# EasyEDA Pro project whisker-breeze.epro, schematic Schematic1_2
Board Name: Rev.B; Create Date: 2025-09-19; Page Name: P1; Project Name: 风扇调速器; Schematic Name: Schematic1_2; Update Date: 2025-09-20; Company: 嘉立创EDA; Page Size: A4; Version: V1.0
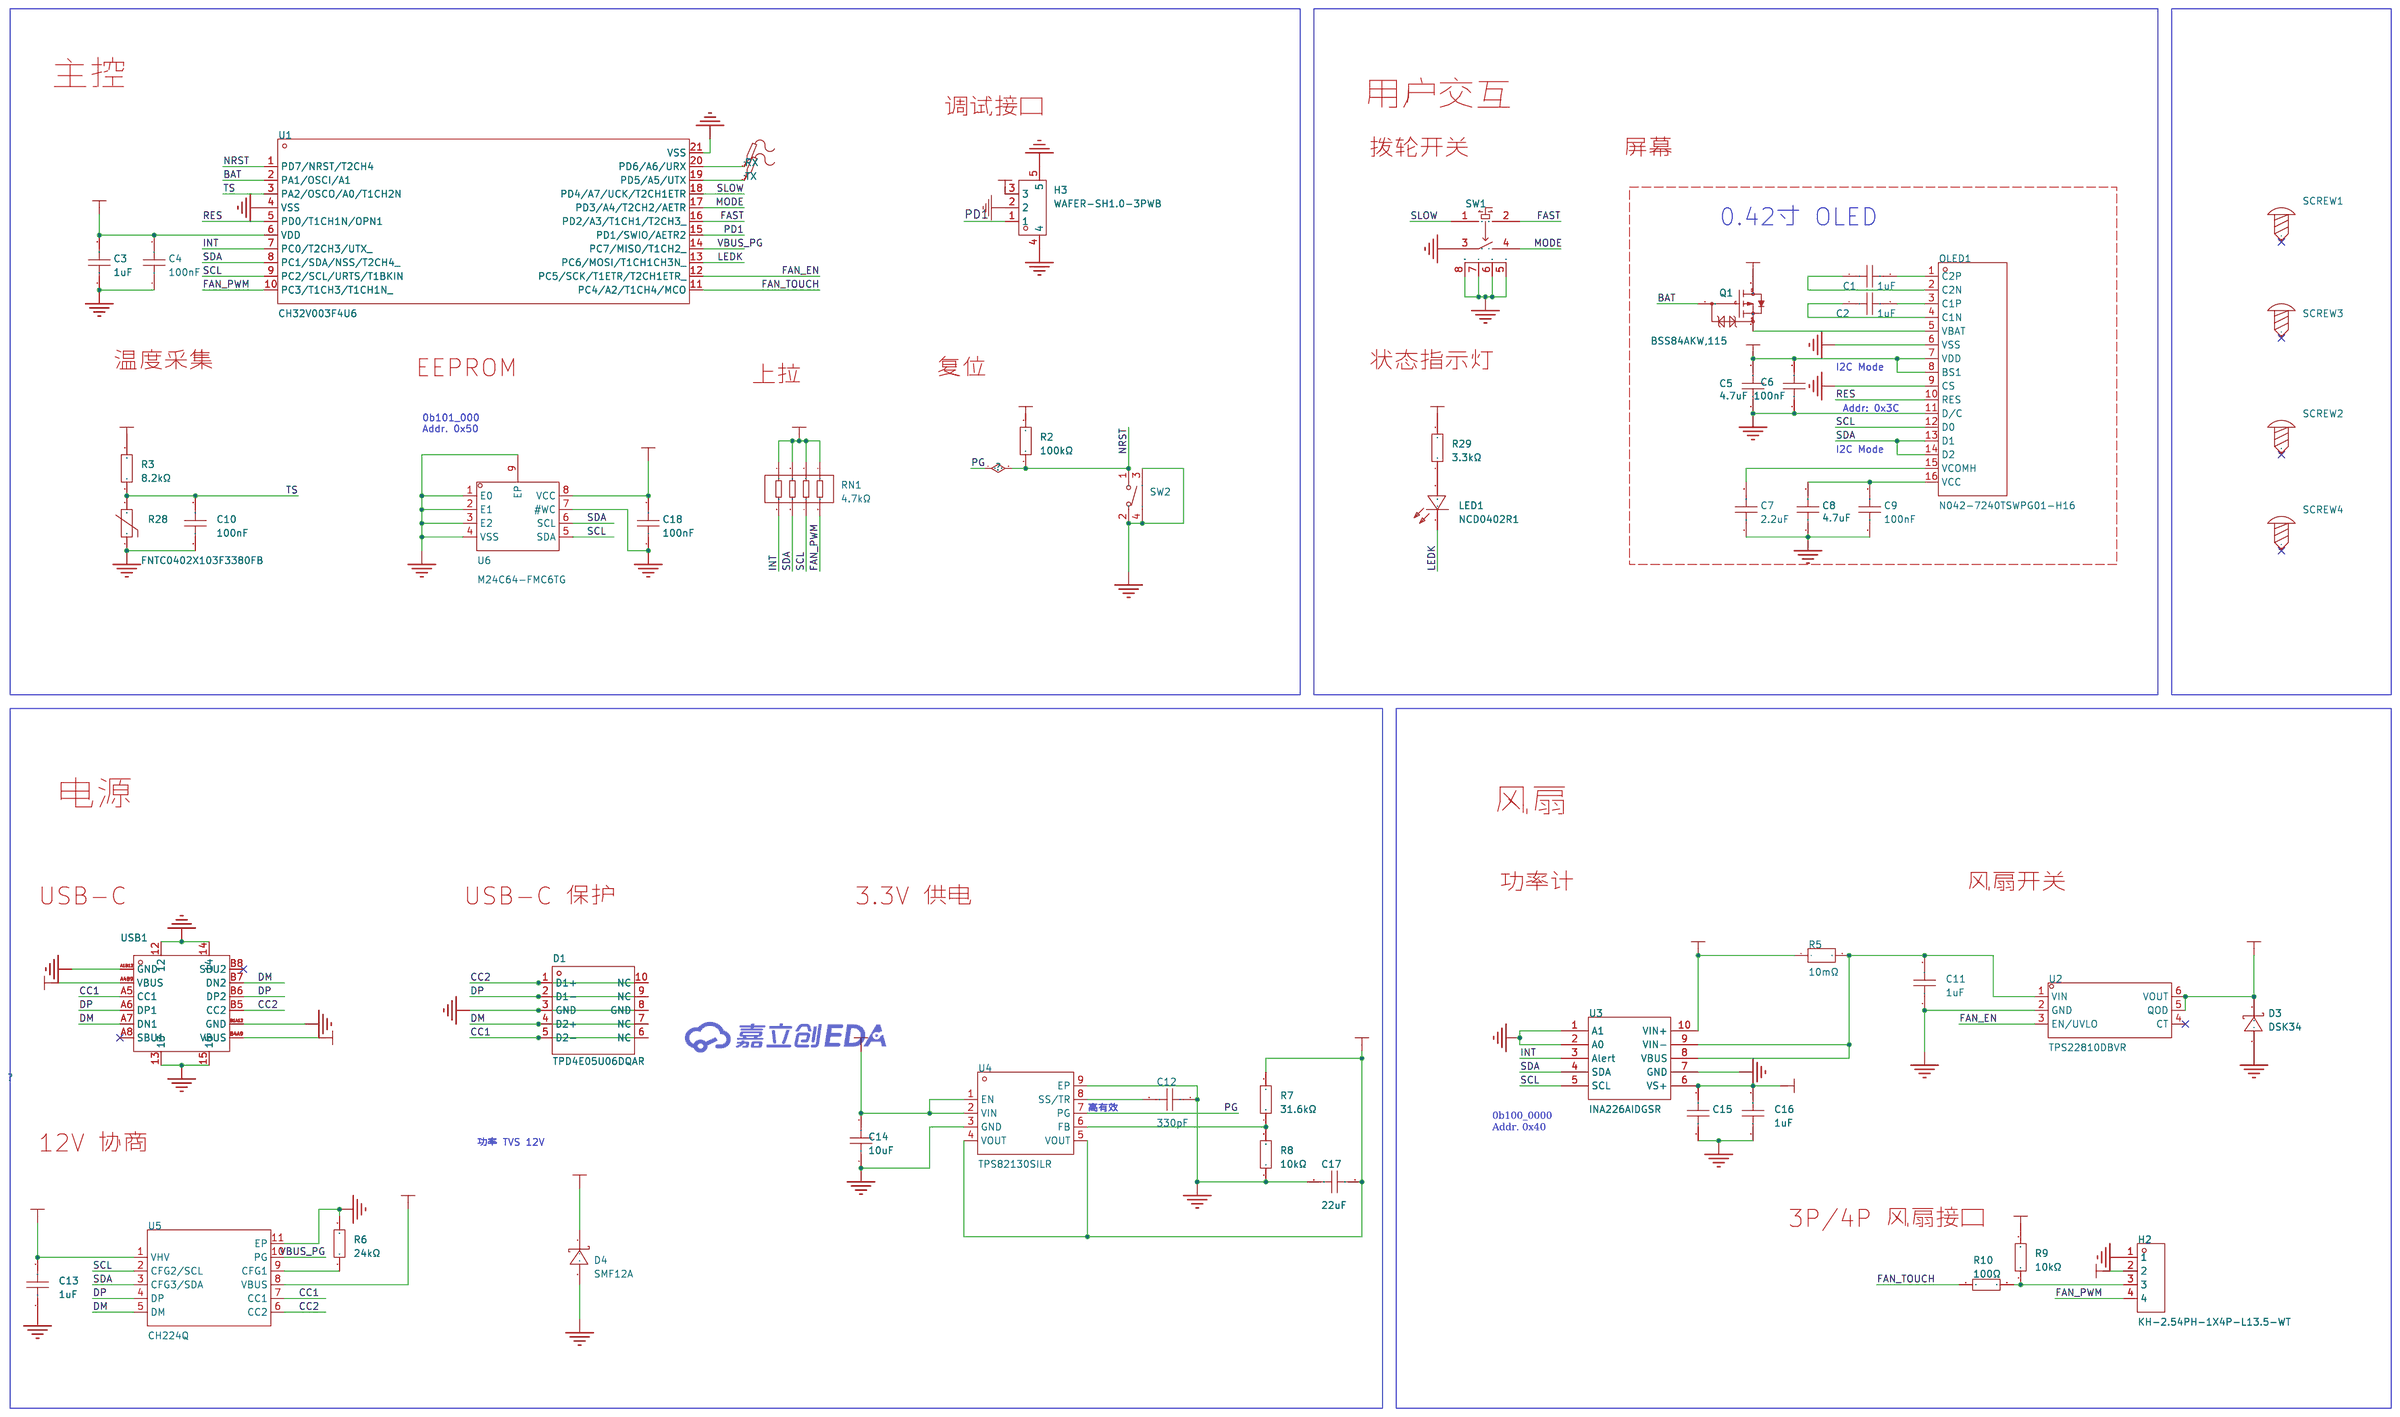
[diagram p1: schematic sheet]

## Parts
C1  1uF  [C0402]
C2  1uF  [C0402]
C3  1uF  [C0402]
C4  100nF  [C0402]
C5  4.7uF  [C0402]
C6  100nF  [C0402]
C7  2.2uF  [C0402]
C8  4.7uF  [C0402]
C9  100nF  [C0402]
C10  100nF  [C0402]
C11  1uF  [C0402]
C12  330pF  [C0402]
C13  1uF  [C0402]
C14  10uF  [C0402]
C15  100nF  [C0402]
C16  1uF  [C0402]
C17  22uF  [C0603]
C18  100nF  [C0402]
D1  TPD4E05U06DQAR  [USON-10_L2.5-W1.0-P0.50-BL]
D3  DSK34  [SOD-123_L2.8-W1.8-LS3.7-RD]
D4  SMF12A  [SOD-123F_L2.8-W1.8-LS3.7-RD]
H2  KH-2.54PH-1X4P-L13.5-WT  [HDR-SMD_4P-P2.54-H-M-W13.3-N]
H3  WAFER-SH1.0-3PWB  [CONN-SMD_3P-P1.00_WAFER-SH1.0-3PWB]
LED1  NCD0402R1  [LED0402-RD]
OLED1  N042-7240TSWPG01-H16  [OLED-SMD_L23.0-W12.0_N042-7240TSWPG01-H16]
Q1  BSS84AKW,115  [SOT-323-3_L2.0-W1.3-P1.30-LS2.1-BR]
R2  100kΩ  [R0402]
R3  8.2kΩ  [R0402]
R5  10mΩ  [R1206]
R6  24kΩ  [R0402]
R7  31.6kΩ  [R0402]
R8  10kΩ  [R0402]
R9  10kΩ  [R0402]
R10  100Ω  [R0402]
R28  FNTC0402X103F3380FB  [R0402]
R29  3.3kΩ  [R0402]
RN1  4.7kΩ  [RES-ARRAY-SMD_0402-8P-L2.0-W1.0-BL]
RX  -  [Test-Point-0.5mm]
SCREW1  -  [M2螺丝]
SCREW2  -  [M2螺丝]
SCREW3  -  [M2螺丝]
SCREW4  -  [M2螺丝]
SW1  TM-2024A  [SW-SMD_TM-2024A]
SW2  TS24CA 250gf 013  [SW-SMD_L4.7-W3.5-P3.35-EH]
TX  -  [Test-Point-0.5mm]
U1  CH32V003F4U6  [QFN-20_L3.0-W3.0-P0.40-TL-EP1.7]
U2  TPS22810DBVR  [SOT-23-6_L2.9-W1.6-P0.95-LS2.8-BL]
U3  INA226AIDGSR  [MSOP-10_L3.0-W3.0-P0.50-LS5.0-BL]
U4  TPS82130SILR  [USIP-8_L3.0-W2.8-P0.65-TL-EP]
U5  CH224Q  [DFN-10_L2.0-W2.0-P0.40-BL-EP]
U6  M24C64-FMC6TG  [DFN-8_L3.0-W2.0-P0.50-BL-EP]
USB1  TYPEC-304A-ACP16O  [USB-SMD_TYPEC-304A-ACP16O]

## Library data of the parts
C1 C2 = CL05A105KP5NNNC: 容值:1uF;精度:±10%;额定电压:10V;材质(温度系数):X5R;; LCSC Part Name: 1uF ±10% 10V; Supplier Part: C14445; Manufacturer: SAMSUNG(三星); Supplier Footprint: 0402; JLCPCB Part Class: Extended Part; Datasheet: https://atta.szlcsc.com/upload/public/pdf/source/20160218/1457707763339.pdf; Supplier: LCSC; Tolerance: ±10%; Voltage Rated: 10V; Temperature Coefficient: X5R
C3 = GRM155Z71A105KE01D: 容值:1uF;精度:±10%;额定电压:10V;材质(温度系数):X7R;; LCSC Part Name: 1uF ±10% 10V; Supplier Part: C528974; Manufacturer: muRata(村田); Supplier Footprint: 0402; JLCPCB Part Class: 扩展库; Datasheet: https://atta.szlcsc.com/upload/public/pdf/source/20200508/C528974_15BC5D9F0CC13FAE313D74FE55DE6D9B.pdf; Supplier: LCSC; Tolerance: ±10%; Voltage Rating: 10V; Temperature Coefficient: X7R
C4 C6 C9 C15 C18 = GRM155R71H104KE14D: 容值:100nF;精度:±10%;额定电压:50V;材质(温度系数):X7R;; LCSC Part Name: 100nF ±10% 50V; Supplier Part: C77020; Manufacturer: muRata(村田); Supplier Footprint: 0402; JLCPCB Part Class: 扩展库; Datasheet: https://atta.szlcsc.com/upload/public/pdf/source/20180326/C77020_39BD49C951FF1AF0DB1F1FAC5AC1E401.pdf; Supplier: LCSC; Tolerance: ±10%; Voltage Rated: 50V; Temperature Coefficient: X7R
C5 C8 = GRM155R61A475MEAAD: 容值:4.7uF;精度:±20%;额定电压:10V;材质(温度系数):X5R;; LCSC Part Name: 4.7uF ±20% 10V; Supplier Part: C335105; Manufacturer: muRata(村田); Supplier Footprint: 0402; JLCPCB Part Class: 扩展库; Datasheet: https://atta.szlcsc.com/upload/public/pdf/source/20200305/C490387_23319AE8C154DEB24C505E6C82A8106A.pdf; Supplier: LCSC; Tolerance: ±20%; Voltage Rated: 10V; Temperature Coefficient: X5R
C7 = GRM155Z71A225KE01D: 容值:2.2uF;精度:±10%;额定电压:10V;温度系数:X7R;; LCSC Part Name: 2.2uF ±10% 10V; Supplier Part: C2997286; Manufacturer: muRata(村田); Supplier Footprint: 0402; JLCPCB Part Class: 扩展库; Datasheet: https://item.szlcsc.com/datasheet/GRM155Z71A225KE01D/3468099.html; Supplier: LCSC; Tolerance: ±10%; Voltage Rating: 10V; Temperature Coefficient: X7R
C10 = CL05B104KB54PNC: 容值:100nF;精度:±10%;额定电压:50V;材质(温度系数):X7R;; LCSC Part Name: 100nF ±10% 50V; Supplier Part: C307331; Manufacturer: SAMSUNG(三星); Supplier Footprint: 0402; JLCPCB Part Class: 基础库; Datasheet: https://atta.szlcsc.com/upload/public/pdf/source/20160218/1457707763339.pdf; Supplier: LCSC; Tolerance: ±10%; Voltage Rated: 50V; Temperature Coefficient: X7R
C11 C13 = GRM155R61H105KE05D: 容值:1uF;精度:±10%;额定电压:50V;温度系数:X5R;; LCSC Part Name: 1uF ±10% 50V; Supplier Part: C1518208; Manufacturer: muRata(村田); Supplier Footprint: 0402; JLCPCB Part Class: 扩展库; Datasheet: https://item.szlcsc.com/datasheet/GRM155R61H105KE05D/1609005.html; Supplier: LCSC; Tolerance: ±10%; Voltage Rating: 50V; Temperature Coefficient: X5R
C12 = GCM1555C1H331FA16D: 容值:330pF;精度:±1%;额定电压:50V;材质(温度系数):C0G;; LCSC Part Name: 330pF ±1% 50V; Supplier Part: C1864355; Manufacturer: muRata(村田); Supplier Footprint: 0402; JLCPCB Part Class: 扩展库; Datasheet: https://atta.szlcsc.com/upload/public/pdf/source/20201110/C913633_3418F3A3655A055367457A71830DC7FB.pdf; Supplier: LCSC; Tolerance: ±1%; Voltage Rated: 50V; Temperature Coefficient: C0G
C14 = CL05A106MP5NUNC: 容值:10uF;精度:±20%;额定电压:10V;材质(温度系数):X5R;; LCSC Part Name: 10uF ±20% 10V; Supplier Part: C315248; Manufacturer: SAMSUNG(三星); Supplier Footprint: 0402; JLCPCB Part Class: 扩展库; Datasheet: https://atta.szlcsc.com/upload/public/pdf/source/20231220/1EF805BAE1520675928CC4638D279E74.pdf; Supplier: LCSC; Tolerance: ±20%; Voltage Rated: 10V; Temperature Coefficient: X5R
C16 = GRM155Z71A105KE01D: 容值:1uF;精度:±10%;额定电压:10V;材质(温度系数):X7R;; LCSC Part Name: 1uF ±10% 10V; Supplier Part: C528974; Manufacturer: muRata(村田); Supplier Footprint: 0402; JLCPCB Part Class: 扩展库; Datasheet: https://atta.szlcsc.com/upload/public/pdf/source/20200508/C528974_15BC5D9F0CC13FAE313D74FE55DE6D9B.pdf; Supplier: LCSC; Tolerance: ±10%; Voltage Rating: 10V; Temperature Coefficient: X7R; Voltage Rated: 10V
C17 = GRM188R60J226MEA0D: 容值:22uF;精度:±20%;额定电压:6.3V;材质(温度系数):X5R;; LCSC Part Name: 22uF ±20% 6.3V; Supplier Part: C77042; Manufacturer: muRata(村田); Supplier Footprint: 0603; JLCPCB Part Class: 扩展库; Datasheet: https://atta.szlcsc.com/upload/public/pdf/source/20200305/C490387_23319AE8C154DEB24C505E6C82A8106A.pdf; Supplier: LCSC; Tolerance: ±20%; Voltage Rated: 6.3V; Temperature Coefficient: X5R
D1 = TPD4E05U06DQAR_C138714: 极性:单向;反向截止电压(Vrwm):5.5V;最大钳位电压:14V;峰值脉冲电流(Ipp)@10/1000us:2.5A;峰值脉冲功率(Ppp)@10/1000us:40W;击穿电压:6V;; LCSC Part Name: 单向ESD; Supplier Part: C138714; Manufacturer: TI(德州仪器); Supplier Footprint: USON-10(1x2.5); JLCPCB Part Class: 扩展库; Datasheet: https://www.ti.com/cn/lit/gpn/tpd4e05u06; Supplier: LCSC; polarity: 单向; Reverse Stand-Off Voltage (Vrwm): 5.5V; Maximum Clamping Voltage: 14V; Peak Pulse Current (Ipp)@10/1000us: 2.5A; Peak Pulse Power Dissipation (Ppp)@10/1000us: 40W; Breakdown Voltage: 6V; Number of Lines: 四路; Operating Temperature: -40℃~+125℃@(Ta); Type: ESD
D3 = DSK34_C41029: 二极管配置:独立式;正向压降(Vf):550mV@3A;直流反向耐压(Vr):40V;整流电流:3A;; LCSC Part Name: 电压:40V 电流:3A; Supplier Part: C41029; Manufacturer: MDD(辰达半导体); Supplier Footprint: SOD-123FL; JLCPCB Part Class: 扩展库; Datasheet: https://atta.szlcsc.com/upload/public/pdf/source/20240710/931B7979AEEE628A0AE48522F9F6A0BB.pdf; Supplier: LCSC; Diode Configuration: 独立式; Forward Voltage (Vf@If): 550mV@3A; Reverse Voltage (Vr): 40V; Rectified Current: 3A; Reverse Leakage Current (Ir): 500uA@40V
D4 = SMF12A_C207255: 反向截止电压(Vrwm):12V;钳位电压:19.9V;峰值脉冲电流(Ipp):10.1A;峰值脉冲功率(Ppp):200W@10/1000us;击穿电压:14.7V;; Supplier Part: C207255; Manufacturer: Littelfuse(美国力特); Supplier Footprint: SOD-123F; JLCPCB Part Class: 扩展库; Datasheet: https://item.szlcsc.com/datasheet/SMF12A/208374.html; Supplier: LCSC; Reverse Stand-Off Voltage (Vrwm): 12V; Clamping Voltage: 19.9V; Peak Pulse Current (Ipp): 10.1A; Peak Pulse Power Dissipation (Ppp): 200W@10/1000us; Voltage - Breakdown: 14.7V; Reverse Leakage Current (Ir): 2.5uA; Operating Temperature: -65℃~+150℃; level of protection: IEC 61000-4-4；IEC 61000-4-2; Type: TVS
H2 = KH-2.54PH-1X4P-L13.5-WT: 插针结构:1x4P;间距:2.54mm;安装类型:卧贴;排数:单排;; LCSC Part Name: 1x4P 间距:2.54mm 卧贴; Supplier Part: C20610213; Manufacturer: kinghelm(金航标); Supplier Footprint: SMD,P=2.54mm,卧贴; JLCPCB Part Class: Extended Part; Datasheet: https://atta.szlcsc.com/upload/public/pdf/source/20240117/0E03F58DBD0D2B730423A71148A2974D.pdf; Supplier: LCSC; Pin Structure: 1x4P; Pitch: 2.54mm; Mounting Type: 卧贴; Number of Rows: 单排
H3 = WAFER-SH1.0-3PWB: 插针结构:1x3P;间距:1mm;安装方式:卧贴;参考系列:SH;总PIN数:3P;排数:1;每排PIN数:3;行距:-;额定电流:1A;触头材质:黄铜;触头镀层:锡;工作温度:-40℃~+85℃;; LCSC Part Name: 1x3P 间距:1mm 卧贴 系列:SH; Supplier Part: C3029342; Manufacturer: XUNPU(讯普); Supplier Footprint: SMD,P=1mm,卧贴; JLCPCB Part Class: 扩展库; Datasheet: https://item.szlcsc.com/datasheet/WAFER-SH1.0-3PWB/3561354.html; Supplier: LCSC; Pins Structure: 1x3P; Pitch: 1mm; Mounting Type: 卧贴; Reference Series: SH; Number of Pins: 3P; Number of Rows: 1; Number of PINs Per Row: 3; Current Rating: 1A; Contact Material: 黄铜; Contact Plating: 锡; Operating Temperature: -40℃~+85℃; Voltage Rating: 50V; Plastic Material: LCP; Supplementary Features: 辅助焊脚; Color: 米色; Z-Height of the Board: 3.15mm; X-Length of Bottom Edge on Board (Spacing Line): 5.35mm; Y-Width of Bottom Edge on Board: 4.3mm
LED1 = NCD0402R1: 发光颜色:红色;正向压降(Vf):1.6V~2.6V;功率:65mW;正向电流:25mA;波长:615nm~635nm;透镜颜色:-;发光强度:30mcd;发光角度:130°;工作温度:-30℃~+85℃;; LCSC Part Name: 片式发光二极管; Supplier Part: C130719; Manufacturer: 国星光电; Supplier Footprint: 0402; JLCPCB Part Class: 扩展库; Datasheet: https://item.szlcsc.com/datasheet/NCD0402R1/142008.html; Supplier: LCSC; Illumination Color: 红色; Voltage - Forward(Vf): 1.6V~2.6V; Power(Watts): 65mW; Forward Current: 25mA; Wavelength - Dominant: 615nm~635nm; Peak Wavelength: 630nm; Luminous Intensity: 30mcd; Viewing Angle: 130°; Operating Temperature: -30℃~+85℃
OLED1 = 0.42-72*40 OLED 背: 主控芯片:SSD1306;接口类型:I2C;尺寸(inch):0.42;像素分辨率:72x40;; LCSC Part Name: 0.42寸 白光 72x40像素分辨率 16PIN; Supplier Part: C2890602; Manufacturer: Newvision(新智景); Datasheet: https://atta.szlcsc.com/upload/public/pdf/source/20220616/8E4FF058E99944D2E326A1AA19D8CE74.pdf; Supplier: LCSC; Main Control Chip: SSD1315; Interface Type: I2C; Size: 0.42; Pixel Resolution: 72x40; Operating Temperature: -40℃~+85℃
Q1 = BSS84AKW,115: 数量:1个P沟道;漏源电压(Vdss):50V;连续漏极电流(Id):150mA;导通电阻(RDS(on)):7.5Ω@10V;耗散功率(Pd):260mW;阈值电压(Vgs(th)):2.1V@250uA;; LCSC Part Name: 1个P沟道 耐压:50V 电流:150mA; Supplier Part: C179347; Manufacturer: Nexperia(安世); Supplier Footprint: SC-70; JLCPCB Part Class: 扩展库; Datasheet: https://item.szlcsc.com/datasheet/BSS84AKW%252C115/190741.html; Supplier: LCSC; Number: 1个P沟道; Drain to Source Voltage: 50V; Current - Continuous Drain(Id): 150mA; RDS(on): 7.5Ω@10V; Pd - Power Dissipation: 260mW; Gate Threshold Voltage (Vgs(th)): 2.1V@250uA; Gate Charge(Qg): 350pC@5V; Input Capacitance(Ciss): 36pF; Reverse Transfer Capacitance (Crss@Vds): 1.3pF; Operating Temperature: -55℃~+150℃@(Tj); Type: P沟道
R2 = 0402WGF1003TCE: 电阻类型:厚膜电阻;阻值:100kΩ;精度:±1%;功率:62.5mW;最大工作电压:50V;温度系数:±100ppm/℃;; LCSC Part Name: 100kΩ ±1% 62.5mW 厚膜电阻; Supplier Part: C25741; Manufacturer: UNI-ROYAL(厚声); Supplier Footprint: 0402; JLCPCB Part Class: 基础库; Datasheet: https://atta.szlcsc.com/upload/public/pdf/source/20200306/C422600_1E6D84923E4A46A82E41ADD87F860B5C.pdf; Supplier: LCSC; Type: 厚膜电阻; Tolerance: ±1%; Power(Watts): 62.5mW; Overload Voltage (Max): 50V; Temperature Coefficient: ±100ppm/℃; Operating Temperature Range: -55℃~+155℃
R3 = 0402WGF8201TCE: 电阻类型:厚膜电阻;阻值:8.2kΩ;精度:±1%;功率:62.5mW;最大工作电压:50V;温度系数:±100ppm/℃;; LCSC Part Name: 8.2kΩ ±1% 62.5mW 厚膜电阻; Supplier Part: C25924; Manufacturer: UNI-ROYAL(厚声); Supplier Footprint: 0402; JLCPCB Part Class: 扩展库; Datasheet: https://atta.szlcsc.com/upload/public/pdf/source/20200306/C422600_1E6D84923E4A46A82E41ADD87F860B5C.pdf; Supplier: LCSC; Type: 厚膜电阻; Tolerance: ±1%; Power(Watts): 62.5mW; Overload Voltage (Max): 50V; Temperature Coefficient: ±100ppm/℃; Operating Temperature Range: -55℃~+155℃
R5 = HoLR1206-1W-10mR-1%-75ppm: 电阻类型:采样电阻;阻值:10mΩ;精度:±1%;功率:1W;温度系数:±75ppm/℃;安装方式:贴片;; LCSC Part Name: 10mΩ ±1% 1W; Supplier Part: C601097; Manufacturer: Milliohm(毫欧); Supplier Footprint: 1206; JLCPCB Part Class: 扩展库; Datasheet: https://atta.szlcsc.com/upload/public/pdf/source/20200610/C601097_3C3A0FBF302E16C37BD368779C6D6328.pdf; Supplier: LCSC; Type: 采样电阻; Tolerance: ±1%; Power(Watts): 1W; Temperature Coefficient: ±75ppm/℃; Mounting Sytle: 贴片
R6 = 0402WGF2402TCE: 电阻类型:厚膜电阻;阻值:24kΩ;精度:±1%;功率:62.5mW;最大工作电压:50V;温度系数:±100ppm/℃;; LCSC Part Name: 24kΩ ±1% 62.5mW 厚膜电阻; Supplier Part: C25769; Manufacturer: UNI-ROYAL(厚声); Supplier Footprint: 0402; Datasheet: https://atta.szlcsc.com/upload/public/pdf/source/20200306/C422600_1E6D84923E4A46A82E41ADD87F860B5C.pdf; Supplier: LCSC; Type: 厚膜电阻; Tolerance: ±1%; Power(Watts): 62.5mW; Overload Voltage (Max): 50V; Temperature Coefficient: ±100ppm/℃; Operating Temperature Range: -55℃~+155℃
R7 = 0402WGF3162TCE: 电阻类型:厚膜电阻;阻值:31.6kΩ;精度:±1%;功率:62.5mW;最大工作电压:50V;温度系数:±100ppm/℃;; LCSC Part Name: 31.6kΩ ±1% 62.5mW 厚膜电阻; Supplier Part: C11463; Manufacturer: UNI-ROYAL(厚声); Supplier Footprint: 0402; JLCPCB Part Class: 扩展库; Datasheet: https://atta.szlcsc.com/upload/public/pdf/source/20200306/C422600_1E6D84923E4A46A82E41ADD87F860B5C.pdf; Supplier: LCSC; Type: 厚膜电阻; Tolerance: ±1%; Power(Watts): 62.5mW; Overload Voltage (Max): 50V; Temperature Coefficient: ±100ppm/℃; Operating Temperature Range: -55℃~+155℃
R8 R9 = 0402WGF1002TCE: 电阻类型:厚膜电阻;阻值:10kΩ;精度:±1%;功率:62.5mW;最大工作电压:50V;温度系数:±100ppm/℃;; LCSC Part Name: 10kΩ ±1% 62.5mW 厚膜电阻; Supplier Part: C25744; Manufacturer: UNI-ROYAL(厚声); Supplier Footprint: 0402; JLCPCB Part Class: Basic Part; Datasheet: https://atta.szlcsc.com/upload/public/pdf/source/20200306/C422600_1E6D84923E4A46A82E41ADD87F860B5C.pdf; Supplier: LCSC; Type: 厚膜电阻; Tolerance: ±1%; Power(Watts): 62.5mW; Overload Voltage (Max): 50V; Temperature Coefficient: ±100ppm/℃; Operating Temperature Range: -55℃~+155℃
R10 = 0402WGF1000TCE: 电阻类型:厚膜电阻;阻值:100Ω;精度:±1%;功率:62.5mW;最大工作电压:50V;温度系数:±200ppm/℃;; LCSC Part Name: 100Ω ±1% 62.5mW 厚膜电阻; Supplier Part: C25076; Manufacturer: UNI-ROYAL(厚声); Supplier Footprint: 0402; JLCPCB Part Class: 基础库; Datasheet: https://atta.szlcsc.com/upload/public/pdf/source/20200306/C422600_1E6D84923E4A46A82E41ADD87F860B5C.pdf; Supplier: LCSC; Type: 厚膜电阻; Tolerance: ±1%; Power(Watts): 62.5mW; Overload Voltage (Max): 50V; Temperature Coefficient: ±200ppm/℃; Operating Temperature Range: -55℃~+155℃
R28 = FNTC0402X103F3380FB: 阻值:10kΩ;B值(25℃/50℃):3380K;功率:100mW;B值精度:±1%;; Supplier Part: C41417281; Manufacturer: cjiang(长江微电); Supplier Footprint: 0402; JLCPCB Part Class: 扩展库; Datasheet: https://atta.szlcsc.com/upload/public/pdf/source/20240927/680ED90FE3621BD417EAE7BF117A336D.pdf; Supplier: LCSC; Resistance @ 25℃: 10kΩ; B Constant (25℃/50℃): 3380K; Power(Watts): 100mW; B Constant Tolerance: ±1%; Operating Temperature: -40℃~+125℃
R29 = 0402WGF3301TCE: 电阻类型:厚膜电阻;阻值:3.3kΩ;精度:±1%;功率:62.5mW;工作电压:50V;温度系数:±100ppm/℃;; LCSC Part Name: 3.3kΩ ±1% 62.5mW 厚膜电阻; Supplier Part: C25890; Manufacturer: UNI-ROYAL(厚声); Supplier Footprint: 0402; JLCPCB Part Class: 基础库; Datasheet: https://item.szlcsc.com/datasheet/0402WGF3301TCE/26633.html; Supplier: LCSC; Type: 厚膜电阻; Tolerance: ±1%; Power(Watts): 62.5mW; Voltage-Supply(Max): 50V; Temperature Coefficient: ±100ppm/℃; Operating Temperature: -55℃~+155℃
RN1 = 4D02WGF4701TCE: 电阻器数:4;阻值:4.7kΩ;精度:±1%;单个元件功率:62.5mW;温度系数:±200ppm/℃;; LCSC Part Name: 4.7kΩ ±1%; Supplier Part: C620895; Manufacturer: UNI-ROYAL(厚声); Supplier Footprint: 0402x4; JLCPCB Part Class: 扩展库; Datasheet: https://atta.szlcsc.com/upload/public/pdf/source/20191224/C474318_2527498AE30E813171187CCD28401A71.pdf; Supplier: LCSC; Number of Resistors: 4; Tolerance: ±1%; Power(Watts): 62.5mW; Temperature Coefficient: ±200ppm/℃; Number of Pins: 8
RX TX = Test-Point: Test Point 测试点
SCREW1-SCREW4 = M2螺丝: Supplier Footprint: 插件
SW1 = TM-2024A: 四脚两档拨轮开关TM-2024A; LCSC Part Name: 四脚两档拨轮开关TM-2024A; Supplier Part: C561480; Manufacturer: XKB Connection(中国星坤); Supplier Footprint: SMD; JLCPCB Part Class: 扩展库; Datasheet: https://atta.szlcsc.com/upload/public/pdf/source/20211011/7A4DB3DC37E7D5823B6D92C66ED3191E.pdf; Supplier: LCSC
SW2 = TS24CA 250gf 013: 电路结构:单刀单掷;按钮形状:矩形按钮;作用力:250gf;安装方式:卧贴;开关长度:4.55mm;开关宽度:1.8mm;开关高度:3.5mm;带支架:不带;触点电流:50mA;额定电压(AC):-;额定电压(DC):12V;额定功率:0.6W;绝缘电阻:100MΩ;带灯:无;机械寿命:3万次;; LCSC Part Name: 2*4*3.5mm半包小贝贝TS-018小侧按键m165蓝牙耳机开关 250gf; Supplier Part: C5373430; Manufacturer: SHOU HAN(首韩); Supplier Footprint: SMD; JLCPCB Part Class: Extended Part; Datasheet: https://atta.szlcsc.com/upload/public/pdf/source/20230321/913029B0FB0CD391AF5EFD51697D8EC4.pdf; Supplier: LCSC; Circuit: 单刀单掷; Actuator Style: 矩形按钮; Operating Force: 250gf; Mounting Style: 卧贴; Switch Length: 4.55mm; Switch Width: 1.8mm; Switch Height: 3.5mm; Strike Gundam: 不带; Contact Current: 50mA; Voltage Rating (DC): 12V; Power Rating: 0.6W; Insulation Resistance: 100MΩ; Actuator/Cap Color: 黑色; With Lamp: 无; Mechanical Life: 3万次; Operating Temperature: -40℃~+85℃
U1 = CH32V003F4U6: CPU内核:RISC-V;程序存储容量:16KB;RAM总容量:2KB;GPIO端口数量:18;工作电压范围:-;CPU最大主频:48MHz;程序存储器类型:-;应用领域:-;; Supplier Part: C5299908; Manufacturer: WCH(南京沁恒); Supplier Footprint: QFN-20(3X3); JLCPCB Part Class: 扩展库; Datasheet: https://atta.szlcsc.com/upload/public/pdf/source/20230221/03A183181E3A5B8E6C6F9D2EA4AA4BE3.pdf; Supplier: LCSC; CPU Core: RISC-V; Program Storage Size: 16KB; RAM Size: 2KB; GPIO Ports Number: 18; CPU Maximum Speed: 48MHz; UART/USART: 1; I2C: 1; SPI: 1; Watchdog: 有; Real-Time Clock: 有
U2 = TPS22810DBVR: 类型:负载开关;通道数:1;输入控制逻辑:高电平有效;最大连续电流:2A;工作电压:2.7V~18V;导通电阻:79mΩ;; Supplier Part: C205990; Manufacturer: TI(德州仪器); Supplier Footprint: SOT-23-6; JLCPCB Part Class: 扩展库; Datasheet: https://www.ti.com/cn/lit/gpn/tps22810; Supplier: LCSC; Type: 负载开关; Number of Channels: 1; Control Input Logic: 高电平有效; Maximum Continuous Current: 2A; Voltage - Supply: 2.7V~18V; RDS(on): 79mΩ; Operating Temperature	-: -40℃~+105℃; Features: 过热保护(OTP)；欠压保护(UVP)
U3 = INA226AIDGSR: INA226 支持报警功能的 36V、双向、超高精度、低侧/高侧、I2C 输出电流/功率监控器; Supplier Part: C49851; Manufacturer: TI(德州仪器); Supplier Footprint: MSOP-10; JLCPCB Part Class: 扩展库; Datasheet: https://www.ti.com/cn/lit/gpn/ina226; Supplier: LCSC; Supply Voltage: 0V~36V; Operating Temperature: -40℃~+125℃
U4 = TPS82130SILR: TPS82130 TPS82130 具有集成电感的 3A 17V 降压转换器; Supplier Part: C473914; Manufacturer: TI(德州仪器); Supplier Footprint: USIP-8; JLCPCB Part Class: 扩展库; Datasheet: https://www.ti.com/cn/lit/gpn/tps82130; Supplier: LCSC; Function: 降压型; Number of Outputs: 1; Voltage - Supply: 3V~17V; Output Voltage Accuracy: ±1.5%; Output Voltage: 900mV~6V; Output Current(Max): 3A; Supply Current (Iq): 20uA; Switching Frequency: 2MHz; Features: 过热保护; Length: 3mm; Width: 2.8mm; Height: 1.5mm; Operating Temperature Range: -40℃~+125℃
U5 = CH224Q_C46061833: 支持USB PD3.2的USB PD快充协议受电芯片，最高支持PD3.2 EPR 140W功率,可广泛用于各类电子设备拓展高功率输入如无线充电器、小家电、锂电池电动工具等各类场合。; Supplier Part: C46061833; Manufacturer: WCH(南京沁恒); Supplier Footprint: DFN-10-EP(2x2); JLCPCB Part Class: 扩展库; Datasheet: https://atta.szlcsc.com/upload/public/pdf/source/20250227/6D68A1393FFD6E9F0B2393231A5DDBA5.pdf; Supplier: LCSC
U6 = M24C64-FMC6TG: 接口类型:I2C;存储容量:64Kbit;; LCSC Part Name: 64 Kbit串行I2C总线EEPROM; Supplier Part: C283446; Manufacturer: ST(意法半导体); Supplier Footprint: DFN-8(2x3); JLCPCB Part Class: 扩展库; Datasheet: https://item.szlcsc.com/datasheet/M24C64-FMC6TG/269181.html; Supplier: LCSC; Interface: I2C; Memory Size: 64Kbit; Voltage - Supply: 1.7V~5.5V; Write Cycle Time(Tw): 5ms; Data Retention - TDR (Year): 200年; Write Cycle Endurance: 400万次; Operating Temperature: -40℃~+85℃
USB1 = TYPEC-304A-ACP16O: 连接器类型:Type-C;标准:USB 3.1;公母:母;端口数量:1;触点数量:16P;安装方式:卧贴;额定电流 - 电源:5A;触头材质:-;触头镀层:-;工作温度范围:-45℃~+85℃;焊接温度(最大值):260℃;; LCSC Part Name: Type-C 母 卧贴; Supplier Part: C2909610; Manufacturer: XUNPU(讯普); Supplier Footprint: SMD; JLCPCB Part Class: 扩展库; Datasheet: https://atta.szlcsc.com/upload/public/pdf/source/20211029/5A76838C591B377E5BF09726BF37DE5A.pdf; Supplier: LCSC; Connector Type: Type-C; Standard: USB 3.1; Gender: 母; Number of Ports: 1; Number of Contacts: 16P; Mounting Style: 卧贴; Current Rating - Power (Max): 5A; Operating Temperature Range: -45℃~+85℃; Soldering Temperature(Max): 260℃

## Nets
3V3: C3.2 C4.2 C5.2 C6.2 C15.2 C16.2 C17.1 C18.2 H3.3 OLED1.7(VDD) OLED1.8(BS1) Q1.3(D) R2.2 R3.2 R7.2 R9.2 R29.2 RN1.1 RN1.2 RN1.3 RN1.4 U1.6(VDD) U3.6(VS+) U4.4(VOUT) U4.5(VOUT) U6.8(VCC)
GND: C3.1 C4.1 C5.1 C6.1 C7.1 C8.1 C9.1 C10.1 C11.1 C12.1 C13.1 C14.1 C15.1 C16.1 C17.2 C18.1 D1.3(GND) D1.8(GND) D3.2(A) D4.2(A) H2.1 H3.2 H3.4 H3.5 OLED1.6(VSS) OLED1.9(CS) OLED1.11(D/C) R6.2 R8.1 R28.1 SW1.3 SW1.5 SW1.6 SW1.7 SW1.8 SW2.2 SW2.3 SW2.4 U1.4(VSS) U1.21(VSS) U2.2(GND) U3.1(A1) U3.2(A0) U3.7(GND) U4.3(GND) U4.9(EP) U5.11(EP) U6.1(E0) U6.2(E1) U6.3(E2) U6.4(VSS) U6.7(#WC) U6.9(EP) USB1.12 USB1.13 USB1.14 USB1.15 USB1.A1B12(GND) USB1.B1A12(GND)
VBUS: C13.2 C14.2 D4.1(K) R5.1 U3.10(VIN+) U4.1(EN) U4.2(VIN) U5.1(VHV) U5.8(VBUS) USB1.A4B9(VBUS) USB1.B4A9(VBUS)
VBUS_PG: U1.14(PC7/MISO/T1CH2_) U5.10(PG)
BAT: Q1.1(G) U1.2(PA1/OSCI/A1)
CC1: D1.5(D2-) D1.6(NC) U5.7(CC1) USB1.A5(CC1)
CC2: D1.1(D1+) D1.10(NC) U5.6(CC2) USB1.B5(CC2)
DM: D1.4(D2+) D1.7(NC) U5.5(DM) USB1.A7(DN1) USB1.B7(DN2)
DP: D1.2(D1-) D1.9(NC) U5.4(DP) USB1.A6(DP1) USB1.B6(DP2)
FAN_EN: U1.12(PC5/SCK/T1ETR/T2CH1ETR_) U2.3(EN/UVLO)
FAN_PWM: H2.4 RN1.8 U1.10(PC3/T1CH3/T1CH1N_)
FAN_TOUCH: R10.1 U1.11(PC4/A2/T1CH4/MCO)
FAST: SW1.2 U1.16(PD2/A3/T1CH1/T2CH3_)
INT: RN1.5 U1.7(PC0/T2CH3/UTX_) U3.3(Alert)
LEDK: LED1.1(K) U1.13(PC6/MOSI/T1CH1CH3N_)
MODE: SW1.4 U1.17(PD3/A4/T2CH2/AETR)
NRST: R2.1 SW2.1 U1.1(PD7/NRST/T2CH4) U4.7(PG)
PD1: H3.1 U1.15(PD1/SWIO/AETR2)
RES: OLED1.10(RES) U1.5(PD0/T1CH1N/OPN1)
SCL: OLED1.12(D0) RN1.7 U1.9(PC2/SCL/URTS/T1BKIN) U3.5(SCL) U5.2(CFG2/SCL) U6.5(SDA)
SDA: OLED1.13(D1) OLED1.14(D2) RN1.6 U1.8(PC1/SDA/NSS/T2CH4_) U3.4(SDA) U5.3(CFG3/SDA) U6.6(SCL)
SLOW: SW1.1 U1.18(PD4/A7/UCK/T2CH1ETR)
TS: C10.2 R3.1 R28.2 U1.3(PA2/OSCO/A0/T1CH2N)
VFAN: D3.1(K) H2.2 U2.5(QOD) U2.6(VOUT)
$1N757: C8.2 C9.2 OLED1.16(VCC)
$1N758: C7.2 OLED1.15(VCOMH)
$1N759: C2.1 OLED1.4(C1N)
$1N760: OLED1.5(VBAT) Q1.2(S)
$1N763: C2.2 OLED1.3(C1P)
$1N764: C1.1 OLED1.2(C2N)
$1N776: C1.2 OLED1.1(C2P)
$1N1343: RX.1 U1.20(PD6/A6/URX)
$1N1345: TX.1 U1.19(PD5/A5/UTX)
$1N2199: C11.2 R5.2 U2.1(VIN) U3.8(VBUS) U3.9(VIN-)
$1N3256: H2.3 R9.1 R10.2
$1N3616: R7.1 R8.2 U4.6(FB)
$1N3620: C12.2 U4.8(SS/TR)
$1N3914: R6.1 U5.9(CFG1)
$1N13951: LED1.2(A) R29.1

Not connected (* = marked no-connect by the designer): SCREW1 1*; SCREW2 1*; SCREW3 1*; SCREW4 1*; U2 4(CT)*; USB1 A8(SBU1)* B8(SBU2)*

## Notes on the sheet
- 主控
- 用户交互
- 调试接口
- 拨轮开关
- 屏幕
- 0.42寸 OLED
- 温度采集
- 状态指示灯
- I2C Mode
- EEPROM
- 上拉
- 复位
- Addr: 0x3C
- 0b101_000
  Addr. 0x50
- I2C Mode
- 电源
- 风扇
- USB-C
- USB-C 保护
- 3.3V 供电
- 功率计
- 风扇开关
- 高有效
- 0b100_0000
  Addr. 0x40
- 功率 TVS 12V
- 12V 协商
- 3P/4P 风扇接口
